# Altium schematic sheet Power.SchDoc
size A4; SheetNumber: 2; SheetTotal: 5
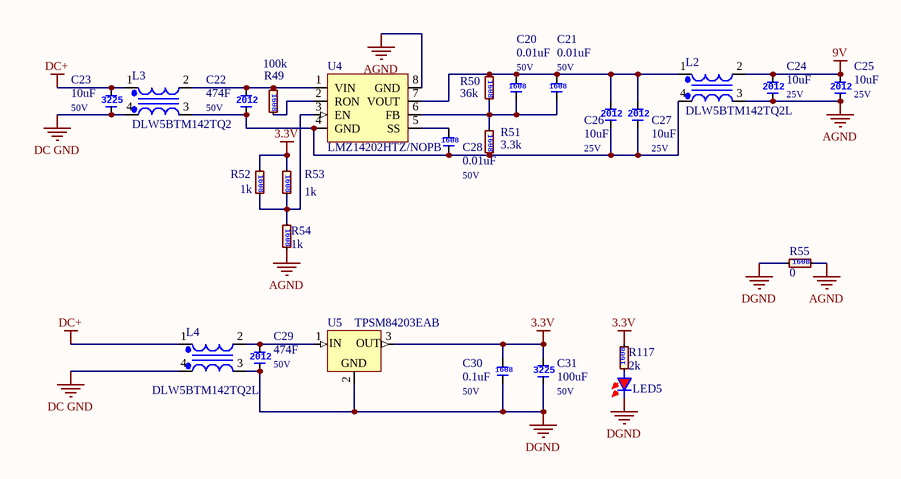
[diagram p0: Power.SchDoc]

## Parts
C20  Tag: 0.01uF  Voltage: 50V  [C1608]  (hidden comment: GCD188R71H103KA01D)
C21  Tag: 0.01uF  Voltage: 50V  [C1608]  (hidden comment: GCD188R71H103KA01D)
C22  Tag: 474F  Voltage: 50V  [C2012]  (hidden comment: GRM21BR71H474MA88)
C23  Tag: 10uF  Voltage: 50V  [C3225]  (hidden comment: UMK325C7106MM-T)
C24  Tag: 10uF  Voltage: 25V  [C2012]  (hidden comment: TMK212BBJ106MG-T)
C25  Tag: 10uF  Voltage: 25V  [C2012]  (hidden comment: TMK212BBJ106MG-T)
C26  Tag: 10uF  Voltage: 25V  [C2012]  (hidden comment: TMK212BBJ106MG-T)
C27  Tag: 10uF  Voltage: 25V  [C2012]  (hidden comment: TMK212BBJ106MG-T)
C28  Tag: 0.01uF  Voltage: 50V  [C1608]  (hidden comment: GCD188R71H103KA01D)
C29  Tag: 474F  Voltage: 50V  [C2012]  (hidden comment: GRM21BR71H474MA88)
C30  Tag: 0.1uF  Voltage: 50V  [C1608]  (hidden comment: CGA3E2X7R1H104K080AA)
C31  Tag: 100uF  Voltage: 50V  [C3225]  (hidden comment: EMK325ABJ107MM-T)
L2  DLW5BTM142TQ2L  [DLW5BTM]
L3  DLW5BTM142TQ2  [DLW5BTM]
L4  DLW5BTM142TQ2L  [DLW5BTM]
LED5  APT1608LSECK/J4-PRV  [LED1608]  (value not drawn)
R49  Tag: 100k  [R1608]  (hidden comment: ERJ-PA3F1003V)
R50  Tag: 36k  [R1608]  (hidden comment: ERJ-PA3F3602V)
R51  Tag: 3.3k  [R1608]  (hidden comment: ERJ-PA3F3301V)
R52  Tag: 1k  [R1608]  (hidden comment: ERJ-PA3F1001V)
R53  Tag: 1k  [R1608]  (hidden comment: ERJ-PA3F1001V)
R54  Tag: 1k  [R1608]  (hidden comment: ERJ-PA3F1001V)
R55  Tag: 0  [R1608]  (hidden comment: RK73Z1JTTD)
R117  Tag: 2k  [R1608]  (hidden comment: ERJ-PA3F2001V)
U4  LMZ14202HTZ/NOPB  [TO-PMOD-7]
U5  TPSM84203EAB  [TO220-3]

## Nets
3.3V: C30.2 C31.2 R52.1 R53.1 R117.2 U5.3(OUT)
9V: C24.2 C25.2 L2.2(Pri+)
AGND: C24.1 C25.1 L2.3(Pri-) R54.2 R55.2 U4.8(GND)
DC GND: C23.1 L3.4(Sec-) L4.4(Sec-)
DC+: C23.2 L3.1(Sec+) L4.1(Sec+)
DGND: C29.1 C30.1 C31.1 L4.3(Pri-) LED5.K R55.1 U5.2(GND)
NetC20_1: C20.1 C21.1 R50.2 R51.1 U4.6(FB)
NetC20_2: C20.2 C21.2 C26.2 C27.2 L2.1(Sec+) R50.1 U4.7(VOUT)
NetC22_1: C22.1 C26.1 C27.1 C28.1 L2.4(Sec-) L3.3(Pri-) R51.2 U4.4(GND)
NetC22_2: C22.2 L3.2(Pri+) R49.1 U4.1(VIN)
NetC28_2: C28.2 U4.5(SS)
NetC29_2: C29.2 L4.2(Pri+) U5.1(IN)
NetLED5_A: LED5.A R117.1
NetR49_2: R49.2 U4.2(RON)
NetR52_2: R52.2 R53.2 R54.1 U4.3(EN)

## Notes on the sheet
- Project Title:
- Project No:
- Size:
- Date:
- A4
- Rev:
- Page Title:
- Sheet:
- of
- (in symbol C1608) 1608
- (in symbol C2012) 2012
- (in symbol C3225) 3225
- (in symbol TF1608) 1608

## Library data of the parts
C20 C21 C28 = C1608: セラコン1608サイズ; Vendor: Murata
C22 C24-C27 C29 = C2012: セラコン2012サイズ; Vendor: Murata
C23 C31 = C3225: セラコン3225サイズ; Vendor: TaiyoYuden
C30 = C1608: セラコン1608サイズ; Vendor: TDK
L2-L4 = ACM3225: コモンモード,1A,4ピン; Vendor: Murata
LED5 = LTST-C190CKT: LED 1608 orange; Vendor: kingbright; Color: Orange
R49-R54 R117 = TF1608: 厚膜チップ抵抗1608サイズ; Vendor: Panasonic
R55 = TF1608: 厚膜チップ抵抗1608サイズ; Vendor: KOA
U4 = LMZ14202HTZ/NOPB: DC DC CONVERTER 5-30V; Vendor: Texas Instruments
U5 = TPSM84203EAB: DC DC CONVERTER 3.3V; Vendor: Texas Instruments